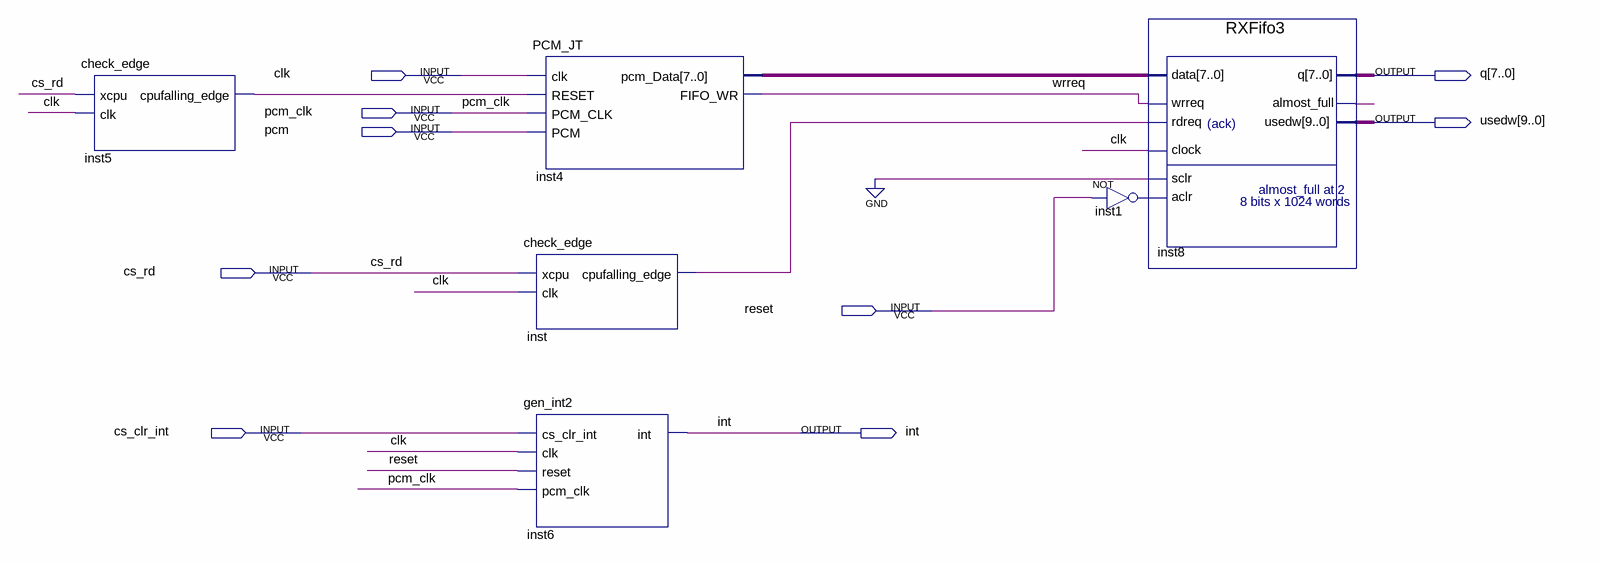
[diagram p0: schematic sheet]
// Quartus schematic DPRU_Interface.bdf as structural Verilog: 6 symbols, 9 pins
module DPRU_Interface (
  input  clk,
  input  pcm_clk,
  input  pcm,
  input  cs_rd,
  input  reset,
  input  cs_clr_int,
  output [7:0] q,
  output [9:0] usedw,
  output \int 
);

  wire inst1_out, inst5_cpufalling_edge, inst8_almost_full, inst_cpufalling_edge, wrreq;
  wire [7:0] inst4_pcm_data;

  check_edge inst5 (.xcpu(cs_rd), .clk(clk), .cpufalling_edge(inst5_cpufalling_edge));
  PCM_JT inst4 (
    .clk(clk), .RESET(inst5_cpufalling_edge), .PCM_CLK(pcm_clk), .PCM(pcm), .pcm_Data(inst4_pcm_data),
    .FIFO_WR(wrreq));
  check_edge inst (.xcpu(cs_rd), .clk(clk), .cpufalling_edge(inst_cpufalling_edge));
  gen_int2 inst6 (.cs_clr_int(cs_clr_int), .clk(clk), .reset(reset), .pcm_clk(pcm_clk), .\int (\int ));
  not inst1 (inst1_out, reset);
  RXFifo3 inst8 (
    .data(inst4_pcm_data), .wrreq(wrreq), .rdreq(inst_cpufalling_edge), .clock(clk), .sclr(1'b0),
    .aclr(inst1_out), .q(q), .almost_full(inst8_almost_full), .usedw(usedw));
endmodule
